# EAGLE design SDI-synchro-drive (EAGLE 7.1.0)
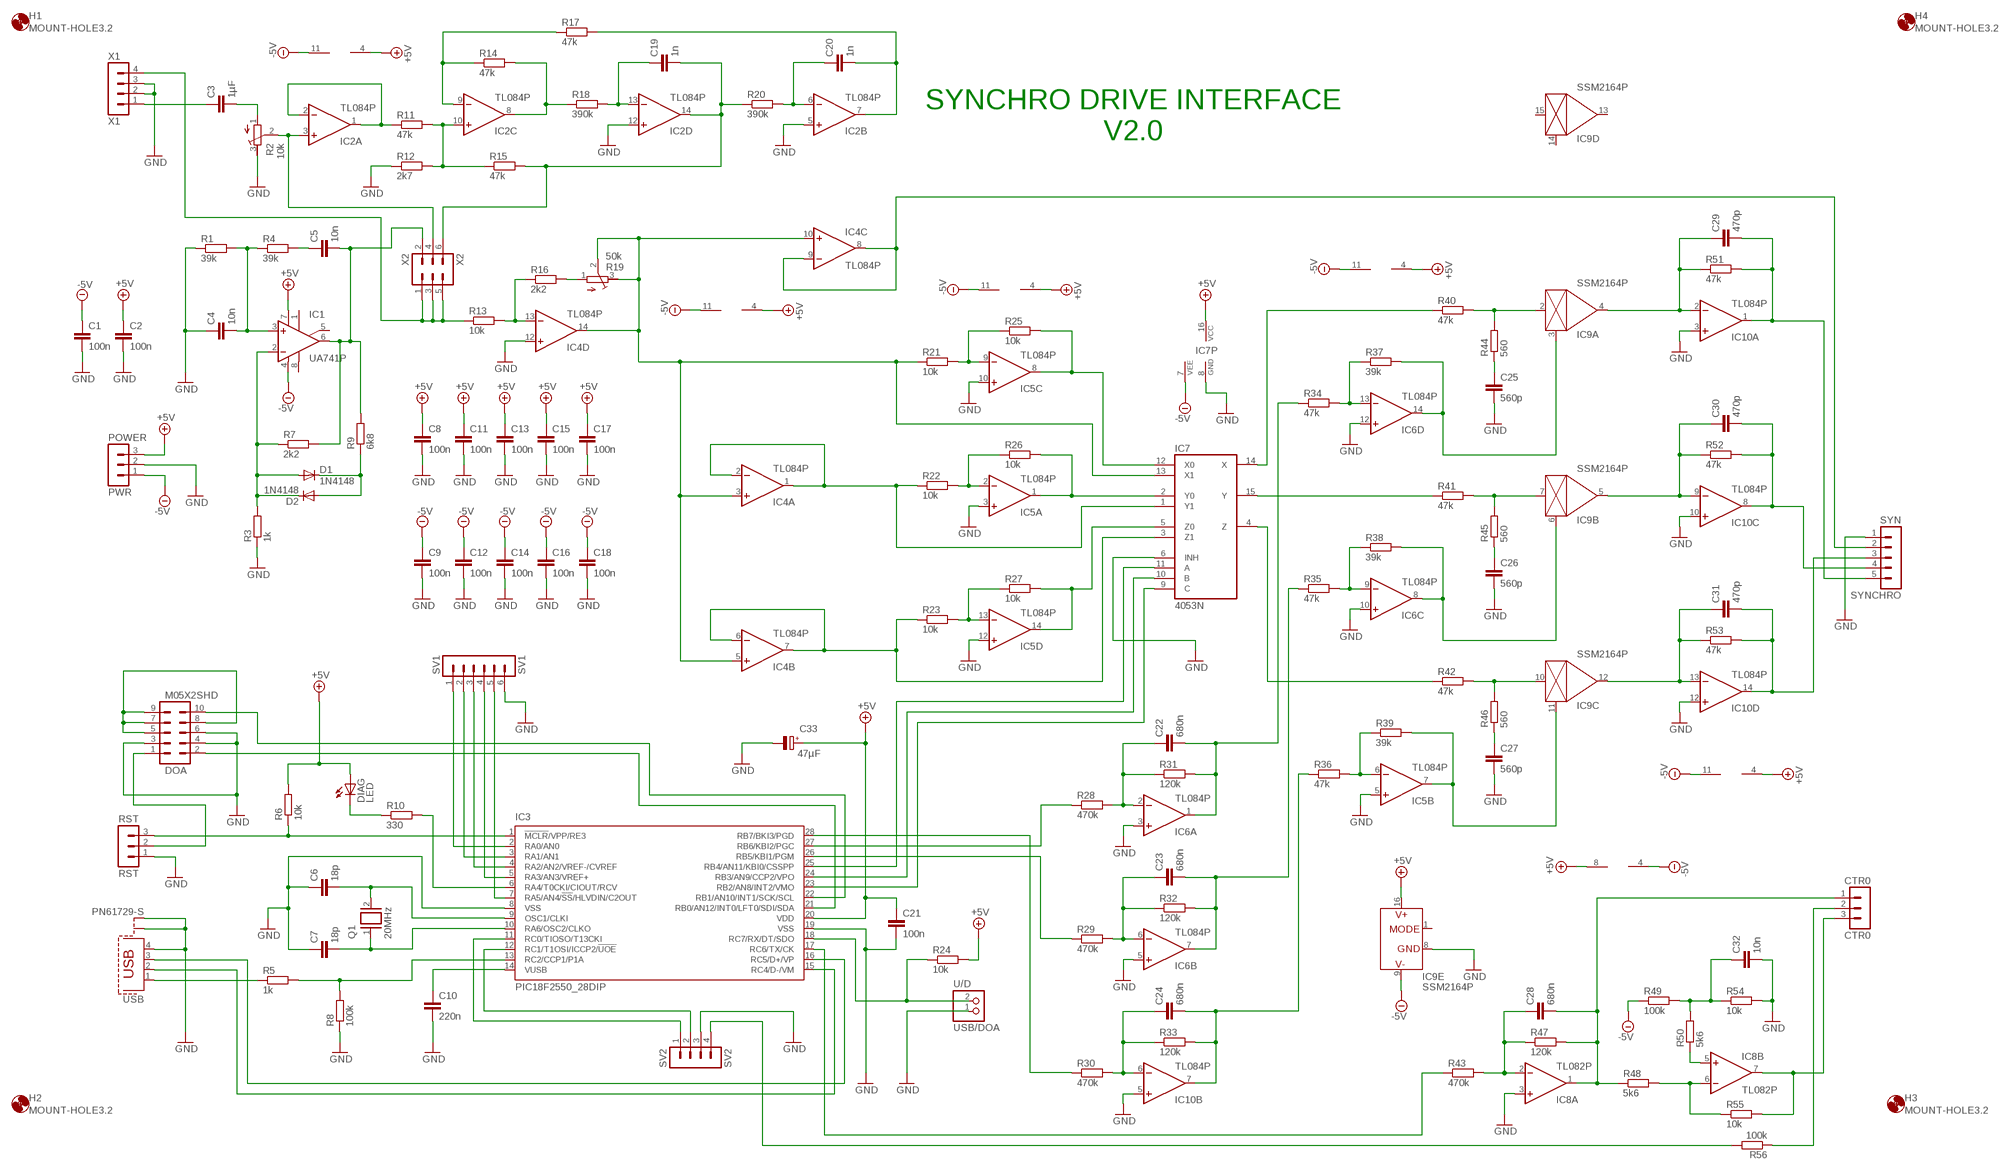
[diagram p0: schematic, sheet 1]

## Parts
C1  100n  C-EU025-025X050  [C025-025X050]
C2  100n  C-EU025-025X050  [C025-025X050]
C3  1µF  C5/3  [C5B3]
C4  10n  C-EU025-025X050  [C025-025X050]
C5  10n  C-EU025-025X050  [C025-025X050]
C6  18p  C-EU025-025X050  [C025-025X050]
C7  18p  C-EU025-025X050  [C025-025X050]
C8  100n  C-EU025-025X050  [C025-025X050]
C9  100n  C-EU025-025X050  [C025-025X050]
C10  220n  C5/3  [C5B3]
C11  100n  C-EU025-025X050  [C025-025X050]
C12  100n  C-EU025-025X050  [C025-025X050]
C13  100n  C-EU025-025X050  [C025-025X050]
C14  100n  C-EU025-025X050  [C025-025X050]
C15  100n  C-EU025-025X050  [C025-025X050]
C16  100n  C-EU025-025X050  [C025-025X050]
C17  100n  C-EU025-025X050  [C025-025X050]
C18  100n  C-EU025-025X050  [C025-025X050]
C19  1n  C-EU025-025X050  [C025-025X050]
C20  1n  C-EU025-025X050  [C025-025X050]
C21  100n  C-EU025-025X050  [C025-025X050]
C22  680n  C5/3  [C5B3]
C23  680n  C5/3  [C5B3]
C24  680n  C5/3  [C5B3]
C25  560p  C-EU025-025X050  [C025-025X050]
C26  560p  C-EU025-025X050  [C025-025X050]
C27  560p  C-EU025-025X050  [C025-025X050]
C28  680n  C5/3  [C5B3]
C29  470p  C-EU025-025X050  [C025-025X050]
C30  470p  C-EU025-025X050  [C025-025X050]
C31  470p  C-EU025-025X050  [C025-025X050]
C32  10n  C-EU025-025X050  [C025-025X050]
C33  47µF  CPOL-EUE2.5-6  [E2,5-6]
CTR0  CTR0  MA03-1  [MA03-1]
D1  1N4148  1N4148DO35-7  [DO35-7]
D2  1N4148  1N4148DO35-7  [DO35-7]
DIAG  LED  LED3MM  [LED3MM]
DOA  M05X2SHD  [2X5-SHROUDED]
H1  MOUNT-HOLE3.2  [3,2]
H2  MOUNT-HOLE3.2  [3,2]
H3  MOUNT-HOLE3.2  [3,2]
H4  MOUNT-HOLE3.2  [3,2]
IC1  UA741P  [DIL08]
IC2  TL084P  [DIL14]
IC3  PIC18F2550_28DIP  [DIL28-3]
IC4  TL084P  [DIL14]
IC5  TL084P  [DIL14]
IC6  TL084P  [DIL14]
IC7  4053N  [DIL16]
IC8  TL082P  [DIL08]
IC9  SSM2164P  [DIL16]
IC10  TL084P  [DIL14]
POWER  PWR  MA03-1  [MA03-1]
Q1  20MHz  XTAL/S  [QS]
R1  39k  R-EU_0204/7  [0204/7]
R2  10k  R-TRIMM3299W  [RTRIM3299W]
R3  1k  R-EU_0204/7  [0204/7]
R4  39k  R-EU_0204/7  [0204/7]
R5  1k  R-EU_0204/7  [0204/7]
R6  10k  R-EU_0204/7  [0204/7]
R7  2k2  R-EU_0204/7  [0204/7]
R8  100k  R-EU_0204/7  [0204/7]
R9  6k8  R-EU_0204/7  [0204/7]
R10  330  R-EU_0204/7  [0204/7]
R11  47k  R-EU_0204/7  [0204/7]
R12  2k7  R-EU_0204/7  [0204/7]
R13  10k  R-EU_0204/7  [0204/7]
R14  47k  R-EU_0204/7  [0204/7]
R15  47k  R-EU_0204/7  [0204/7]
R16  2k2  R-EU_0204/7  [0204/7]
R17  47k  R-EU_0204/7  [0204/7]
R18  390k  R-EU_0204/7  [0204/7]
R19  50k  R-TRIMM3299W  [RTRIM3299W]
R20  390k  R-EU_0204/7  [0204/7]
R21  10k  R-EU_0204/7  [0204/7]
R22  10k  R-EU_0204/7  [0204/7]
R23  10k  R-EU_0204/7  [0204/7]
R24  10k  R-EU_0204/7  [0204/7]
R25  10k  R-EU_0204/7  [0204/7]
R26  10k  R-EU_0204/7  [0204/7]
R27  10k  R-EU_0204/7  [0204/7]
R28  470k  R-EU_0204/7  [0204/7]
R29  470k  R-EU_0204/7  [0204/7]
R30  470k  R-EU_0204/7  [0204/7]
R31  120k  R-EU_0204/7  [0204/7]
R32  120k  R-EU_0204/7  [0204/7]
R33  120k  R-EU_0204/7  [0204/7]
R34  47k  R-EU_0204/7  [0204/7]
R35  47k  R-EU_0204/7  [0204/7]
R36  47k  R-EU_0204/7  [0204/7]
R37  39k  R-EU_0204/7  [0204/7]
R38  39k  R-EU_0204/7  [0204/7]
R39  39k  R-EU_0204/7  [0204/7]
R40  47k  R-EU_0204/7  [0204/7]
R41  47k  R-EU_0204/7  [0204/7]
R42  47k  R-EU_0204/7  [0204/7]
R43  470k  R-EU_0204/7  [0204/7]
R44  560  R-EU_0204/7  [0204/7]
R45  560  R-EU_0204/7  [0204/7]
R46  560  R-EU_0204/7  [0204/7]
R47  120k  R-EU_0204/7  [0204/7]
R48  5k6  R-EU_0204/7  [0204/7]
R49  100k  R-EU_0204/7  [0204/7]
R50  5k6  R-EU_0204/7  [0204/7]
R51  47k  R-EU_0204/7  [0204/7]
R52  47k  R-EU_0204/7  [0204/7]
R53  47k  R-EU_0204/7  [0204/7]
R54  10k  R-EU_0204/7  [0204/7]
R55  10k  R-EU_0204/7  [0204/7]
R56  100k  R-EU_0204/7  [0204/7]
RST  RST  MA03-1  [MA03-1]
SV1  SV1  MA06-1  [MA06-1]
SV2  SV2  MA04-1  [MA04-1]
SYNCHRO  SYN  MA05-1  [MA05-1]
USB  PN61729-S  [PN61729-S]
USB/DOA  U/D  PINHD-1X2  [1X02]
X1  X1  MA04-1  [MA04-1]
X2  X2  MA03-2  [MA03-2]

## Nets
+5V [+5V]: C2.1 C8.1 C11.1 C13.1 C15.1 C17.1 C21.1 C33.+ DIAG.A IC1.7(V+) IC2.4(P:V+) IC3.20(VDD) IC4.4(P:V+) IC5.4(P:V+) IC6.4(P:V+) IC7.16(VCC) IC8.8(P:V+) IC9.16(E:V+) IC10.4(P:V+) POWER.3 R6.2 R24.2
-5V [-5V]: C1.1 C9.1 C12.1 C14.1 C16.1 C18.1 IC1.4(V-) IC2.11(P:V-) IC4.11(P:V-) IC5.11(P:V-) IC6.11(P:V-) IC7.7(VEE) IC8.4(P:V-) IC9.9(E:V-) IC10.11(P:V-) POWER.1 R49.1
GND [ground]: C1.2 C2.2 C4.1 C6.1 C7.1 C8.2 C9.2 C10.2 C11.2 C12.2 C13.2 C14.2 C15.2 C16.2 C17.2 C18.2 C21.2 C25.2 C26.2 C27.2 C32.2 C33.- DOA.3 DOA.4 DOA.6 IC2.5(B:+IN) IC2.12(D:+IN) IC3.8(VSS) IC3.19(VSS) IC4.12(D:+IN) IC5.3(A:+IN) IC5.5(B:+IN) IC5.10(C:+IN) IC5.12(D:+IN) IC6.3(A:+IN) IC6.5(B:+IN) IC6.10(C:+IN) IC6.12(D:+IN) IC7.6(INH) IC7.8(GND) IC8.3(A:+IN) IC9.8(E:GND) IC10.3(A:+IN) IC10.5(B:+IN) IC10.10(C:+IN) IC10.12(D:+IN) POWER.2 R1.1 R2.3(A) R3.1 R8.1 R12.1 R54.2 RST.1 SV1.6 SV2.3 SYNCHRO.1 USB.4 USB.S1 USB.S2 USB/DOA.1 X1.2 X1.3
N$1: IC8.6(B:-IN) R48.2 R55.1
N$2: CTR0.3 IC8.7(B:OUT) R55.2
N$3: C3.2 R2.1(E)
N$4: IC2.3(A:+IN) R2.2(S) X2.4
N$5: IC2.1(A:OUT) IC2.2(A:-IN) R11.1
N$6: IC2.10(C:+IN) R11.2 R12.2 R15.1
N$7: C20.1 IC2.6(B:-IN) R20.2
N$8: IC2.9(C:-IN) R14.1 R17.1
N$9: IC2.8(C:OUT) R14.2 R18.1
N$10: C19.1 IC2.13(D:-IN) R18.2
N$11: C19.2 IC2.14(D:OUT) R15.2 R20.1 X2.6
N$12: C20.2 IC2.7(B:OUT) R17.2
N$13: R13.1 X1.4 X2.1 X2.3 X2.5
N$14: IC4.13(D:-IN) R13.2 R16.1
N$15: R16.2 R19.1(E)
N$16: IC5.13(D:-IN) R23.2 R27.1
N$17: IC4.8(C:OUT) IC4.9(C:-IN) SYNCHRO.2
N$18: CTR0.2 R56.1
N$19: IC5.2(A:-IN) R22.2 R26.1
N$21: C5.2 IC1.6(OUT) R7.2 R9.2 X2.2
N$23: IC5.9(C:-IN) R21.2 R25.1
N$25: C5.1 R4.2
N$26: IC5.8(C:OUT) IC7.12(X0) R25.2
N$27: IC5.1(A:OUT) IC7.2(Y0) R26.2
N$28: C4.2 IC1.3(+IN) R1.2 R4.1
N$29: IC5.14(D:OUT) IC7.5(Z0) R27.2
N$30: D1.A D2.C IC1.2(-IN) R3.2 R7.1
N$31: D1.C D2.A R9.1
N$32: IC7.14(X) R40.1
N$33: IC9.2(A:IN) R40.2 R44.2
N$34: IC7.15(Y) R41.1
N$35: IC9.7(B:IN) R41.2 R45.2
N$36: IC7.4(Z) R42.1
N$37: IC9.10(C:IN) R42.2 R46.2
N$38: C25.1 R44.1
N$39: C26.1 R45.1
N$40: C27.1 R46.1
N$41: IC5.6(B:-IN) R36.2 R39.1
N$42: IC5.7(B:OUT) IC9.11(C:CTRL) R39.2
N$43: IC6.14(D:OUT) IC9.3(A:CTRL) R37.2
N$44: IC6.8(C:OUT) IC9.6(B:CTRL) R38.2
N$45: IC6.9(C:-IN) R35.2 R38.1
N$46: IC6.13(D:-IN) R34.2 R37.1
N$47: C22.1 IC6.2(A:-IN) R28.2 R31.1
N$48: C22.2 IC6.1(A:OUT) R31.2 R34.1
N$49: C23.1 IC6.6(B:-IN) R29.2 R32.1
N$50: C23.2 IC6.7(B:OUT) R32.2 R35.1
N$51: C10.1 IC3.14(VUSB)
N$52: C24.1 IC10.6(B:-IN) R30.2 R33.1
N$53: C24.2 IC10.7(B:OUT) R33.2 R36.1
N$54: IC3.16(RC5/D+/VP) USB.3
N$55: C29.1 IC9.4(A:OUT) IC10.2(A:-IN) R51.1
N$56: C29.2 IC10.1(A:OUT) R51.2 SYNCHRO.5
N$57: C30.1 IC9.5(B:OUT) IC10.9(C:-IN) R52.1
N$58: C30.2 IC10.8(C:OUT) R52.2 SYNCHRO.4
N$59: C31.1 IC9.12(C:OUT) IC10.13(D:-IN) R53.1
N$60: C31.2 IC10.14(D:OUT) R53.2 SYNCHRO.3
N$61: IC3.15(RC4/D-/VM) USB.2
N$62: R5.1 USB.1
N$63: IC3.13(RC2/CCP1/P1A) R5.2 R8.2
N$64: DOA.1 RST.2
N$65: C7.2 IC3.10(RA6/OSC2/CLKO) Q1.1
N$66: C6.2 IC3.9(OSC1/CLKI) Q1.2
N$67: IC3.1(!MCLR!/VPP/RE3) R6.1 RST.3
N$68: IC3.28(RB7/BKI3/PGD) R30.1
N$69: IC3.26(RB5/KBI1/PGM) R29.1
N$70: IC3.27(RB6/KBI2/PGC) R28.1
N$71 [+5V]: DOA.5 DOA.7 DOA.8 DOA.9
N$72: DOA.2 IC3.21(RB0/AN12/INT0/LFT0/SDI/SDA)
N$73: DIAG.K(C) R10.1
N$74: IC3.6(RA4/T0CKI/CIOUT/RCV) R10.2
N$75: DOA.10 IC3.22(RB1/AN10/INT1/SCK/SCL)
N$76: IC3.18(RC7/RX/DT/SDO) R24.1 USB/DOA.2
N$77: IC3.12(RC1/T1OSI/ICCP2/!UOE) SV2.2
N$78: IC3.25(RB4/AN11/KBI0/CSSPP) IC7.11(A)
N$79: IC3.24(RB3/AN9/CCP2/VPO) IC7.10(B)
N$80: IC3.23(RB2/AN8/INT2/VMO) IC7.9(C)
N$81: IC3.2(RA0/AN0) SV1.1
N$82: IC3.3(RA1/AN1) SV1.2
N$83: IC3.4(RA2/AN2/VREF-/CVREF) SV1.3
N$84: IC3.5(RA3/AN3/VREF+) SV1.4
N$85: IC3.7(RA5/AN4/!SS!/HLVDIN/C2OUT) SV1.5
N$86: IC3.11(RC0/TIOSO/T13CKI) SV2.1
N$87: IC3.17(RC6/TX/CK) R43.1
N$88: C28.1 IC8.2(A:-IN) R43.2 R47.1
N$89: C28.2 CTR0.1 IC8.1(A:OUT) R47.2 R48.1
N$91: C32.1 R49.2 R50.2 R54.1
N$92: IC8.5(B:+IN) R50.1
N$93: C3.1 X1.1
N$94: R56.2 SV2.4
SIN000: IC4.3(A:+IN) IC4.5(B:+IN) IC4.10(C:+IN) IC4.14(D:OUT) IC7.13(X1) R19.2(S) R19.3(A) R21.1
SIN120: IC4.1(A:OUT) IC4.2(A:-IN) IC7.1(Y1) R22.1
SIN240: IC4.6(B:-IN) IC4.7(B:OUT) IC7.3(Z1) R23.1
Unconnected: IC1.1(ON1) IC1.5(ON2) IC1.8(OPT) IC9.1(E:MODE) IC9.13(D:OUT) IC9.14(D:CTRL) IC9.15(D:IN)

## Notes on the sheet
- SYNCHRO DRIVE INTERFACE
  V2.0

## Library data of the parts
C1 C2 C4-C9 C11-C21 C25-C27 C29-C32 = rcl:C-EU: CAPACITOR, European symbol
C3 C10 C22-C24 C28 = capacitor-wima:C: CAPACITOR naming: grid - package width
C33 = resistor:CPOL-EU: POLARIZED CAPACITOR, European symbol
CTR0 POWER RST = con-lstb:MA03-1: PIN HEADER; OC_FARNELL: unknown; OC_NEWARK: unknown
D1 D2 = diode:1N4148: DIODE high speed (Philips)
DIAG = henk:LED: LEDs Standard schematic elements and footprints for 5mm, 3mm, 1206, and 0603 sized LEDs. 5mm - Spark Fun Electronics SKU : COM-00529 (and others)
DOA = henk:M05X2: Header 5x2 Standard 10-pin dual row 0.1" header. Commonly used with AVR-ISP. Use with Spark Fun Electronics SKU: PRT-00778
H1-H4 = holes:MOUNT-HOLE: MOUNTING HOLE with drill center marker
IC1 = linear:*741: OP AMP
IC2 IC4-IC6 IC10 = linear:TL084: OP AMP
IC3 = microchip:PIC18F2*_28: USB Microcontrollers with nanoWatt Technology High-Performance, Enhanced Flash, 28/40/44-Pin, Source: http://ww1.microchip.com/downloads/en/devicedoc/39632c.pdf; MF: MICROCHIP; MPN: PIC18F2550-I/SP; OC_FARNELL: 1523822; OC_NEWARK: 80K6054
IC7 = 40xx:4053: Triple 2-channel ANALOG MULTIPLEXER
IC8 = linear:TL082: OP AMP Data sheet <http://www.ti.com/lit/ds/symlink/tl084a . pdf>; DATA_SHEET: <a href="http://www.ti.com/lit/ds/symlink/tl084a.pdf"> Data sheet </a>
IC9 = ssm2164:SSM2164
Q1 = special:XTAL/S: CRYSTAL
R1 R3-R18 R20-R56 = rcl:R-EU_: RESISTOR, European symbol
R2 R19 = rcl:R-TRIMM: Trimm resistor
SV1 = con-lstb:MA06-1: PIN HEADER; OC_FARNELL: unknown; OC_NEWARK: unknown
SV2 X1 = con-lstb:MA04-1: PIN HEADER; OC_FARNELL: unknown; OC_NEWARK: unknown
SYNCHRO = con-lstb:MA05-1: PIN HEADER; OC_FARNELL: unknown; OC_NEWARK: unknown
USB = con-berg:PN61729-S: BERG USB connector; OC_FARNELL: unknown; OC_NEWARK: unknown
USB/DOA = pinhead:PINHD-1X2: PIN HEADER
X2 = con-lstb:MA03-2: PIN HEADER; OC_FARNELL: unknown; OC_NEWARK: unknown

## Net classes
1 ground: width 0.508 mm
2 +5V: width 0.508 mm
3 -5V: width 0.508 mm

## Board
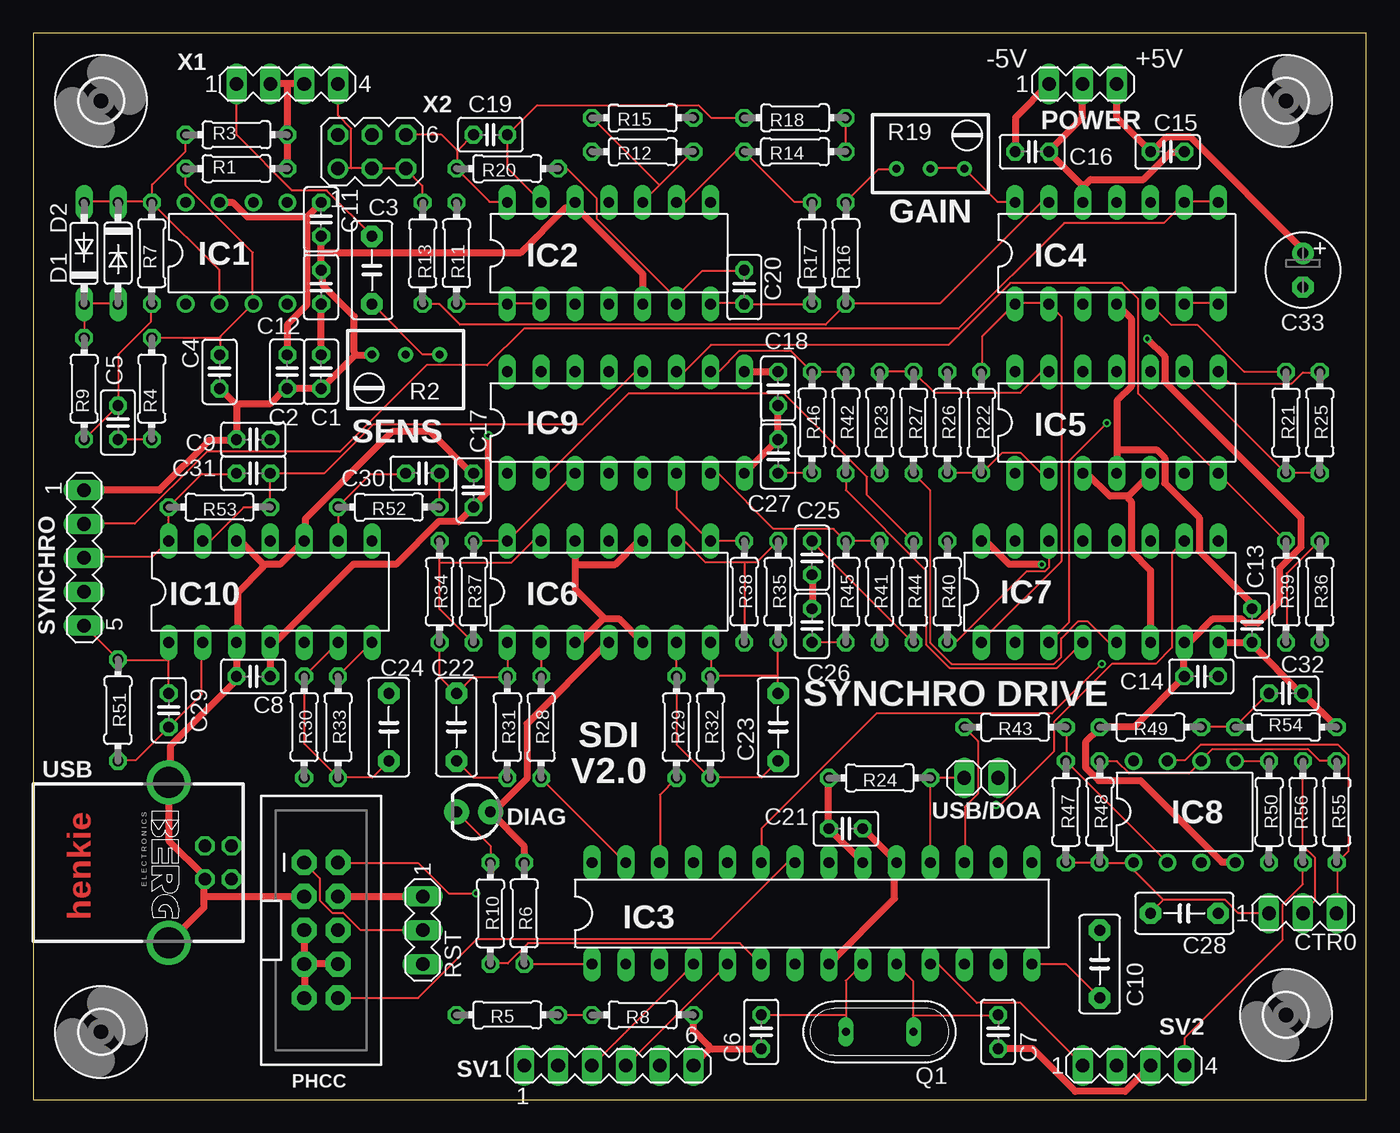
[diagram p1: board, top side]
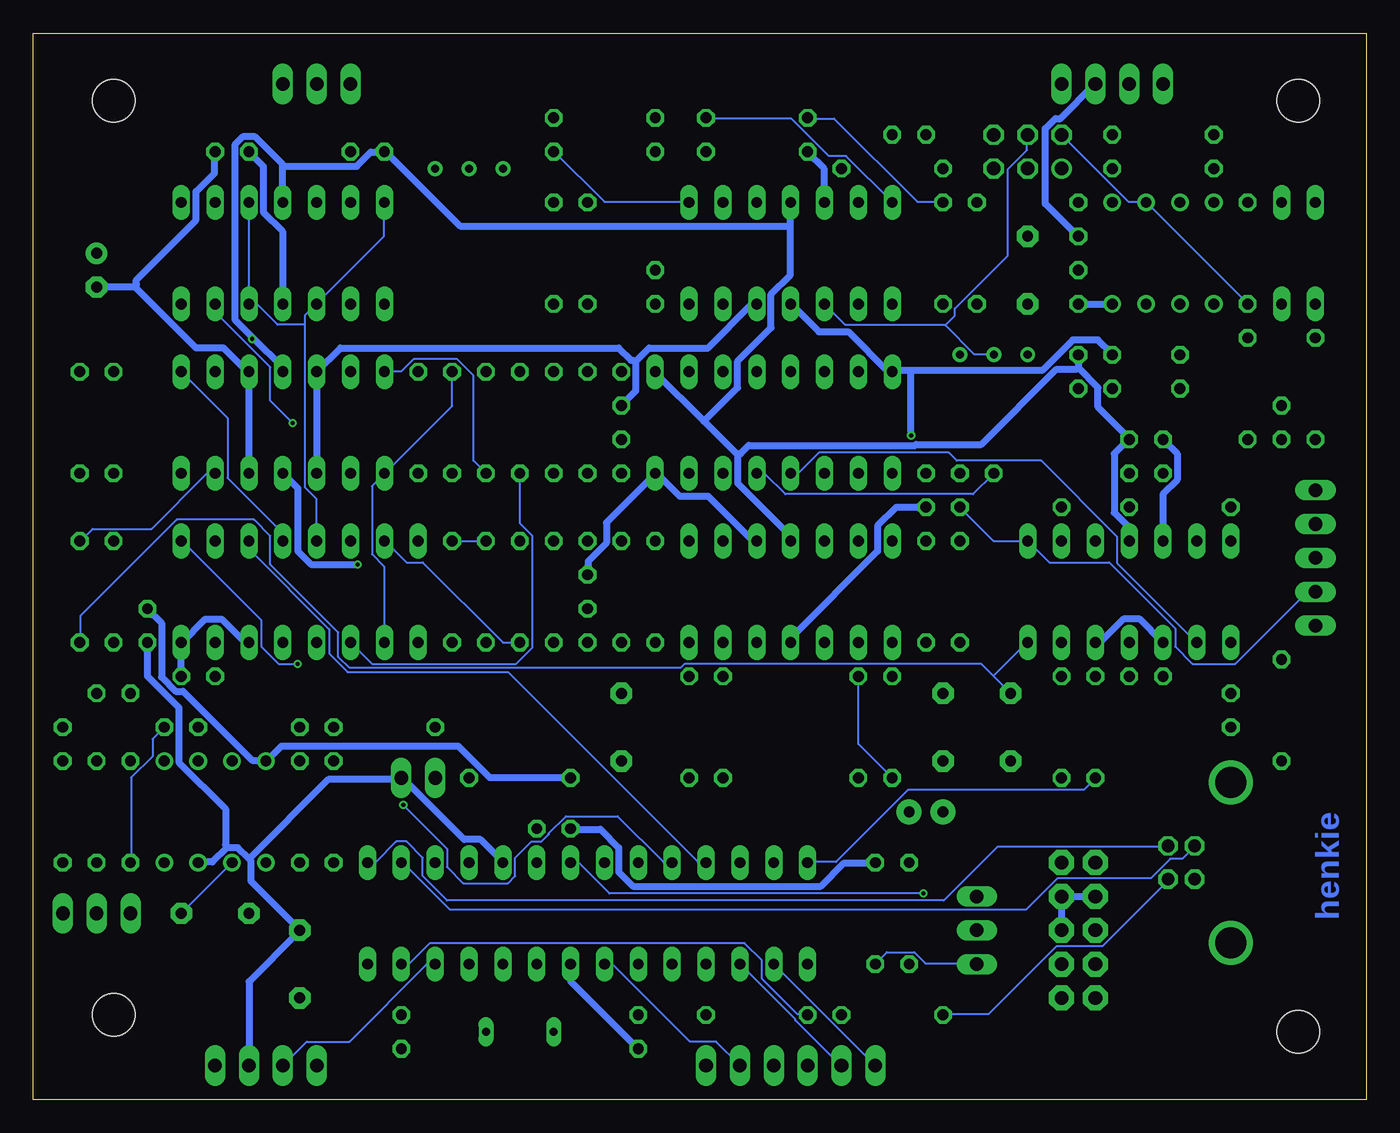
[diagram p2: board, bottom side, seen from below]

Size 100 x 80 mm. Coordinates in mm from the lower left corner, seen from the top.
Outline: 0,0 100,0 100,80 0,80 0,0
Copper layers (1*16): Top 0.035mm / dielectric 1.5mm / Bottom 0.035mm
Design rules "ITEADstudio_DRC": minimum track width 6mil, minimum drill 12mil, track to track 6mil, track to pad 6mil, pad to pad 6mil, via to via 6mil, smd to smd 0mil, copper to edge 10mil, drill to drill 10mil, minimum pad ring 10mil, minimum via ring 6mil, stop-mask expansion 2mil, vias tented up to drill 100mil, thermal gap 10mil

### Footprints (pad centres in the part's own frame; a part is rotated, then mirrored left to right if it is on the bottom)
C025-025X050 = drill 0.813 octagon: 1 -1.27,0; 2 1.27,0
C5B3 = drill 0.813 pad 1.6 octagon: 1 -2.54,0; 2 2.54,0
E2,5-6 = drill 0.813 pad 1.6: + -1.27,0 | drill 0.813 pad 1.6 octagon: - 1.27,0
MA03-1 = drill 1.016 long: 1 -2.54,0; 2 0,0; 3 2.54,0
DO35-7 = drill 0.813 long: A 3.81,0; C -3.81,0
LED3MM = drill 0.813 pad 1.88: A -1.27,0; K 1.27,0
2X5-SHROUDED = drill 1.016 pad 1.88 octagon: 1 -1.27,5.08; 2 1.27,5.08; 3 -1.27,2.54; 4 1.27,2.54; 5 -1.27,0; 6 1.27,0; 7 -1.27,-2.54; 8 1.27,-2.54; 9 -1.27,-5.08; 10 1.27,-5.08
3,2 = hole 3.2: 0,0
DIL08 = drill 0.813 pad 1.27: 1 -3.81,-3.81; 2 -1.27,-3.81; 3 1.27,-3.81; 4 3.81,-3.81; 5 3.81,3.81; 6 1.27,3.81; 7 -1.27,3.81; 8 -3.81,3.81
DIL14 = drill 0.813 long: 1 -7.62,-3.81; 2 -5.08,-3.81; 3 -2.54,-3.81; 4 0,-3.81; 5 2.54,-3.81; 6 5.08,-3.81; 7 7.62,-3.81; 8 7.62,3.81; 9 5.08,3.81; 10 2.54,3.81; 11 0,3.81; 12 -2.54,3.81; 13 -5.08,3.81; 14 -7.62,3.81
DIL28-3 = drill 0.813 long: 1 -16.51,-3.81; 2 -13.97,-3.81; 3 -11.43,-3.81; 4 -8.89,-3.81; 5 -6.35,-3.81; 6 -3.81,-3.81; 7 -1.27,-3.81; 8 1.27,-3.81; 9 3.81,-3.81; 10 6.35,-3.81; 11 8.89,-3.81; 12 11.43,-3.81; 13 13.97,-3.81; 14 16.51,-3.81; 15 16.51,3.81; 16 13.97,3.81; 17 11.43,3.81; 18 8.89,3.81; 19 6.35,3.81; 20 3.81,3.81; 21 1.27,3.81; 22 -1.27,3.81; 23 -3.81,3.81; 24 -6.35,3.81; 25 -8.89,3.81; 26 -11.43,3.81; 27 -13.97,3.81; 28 -16.51,3.81
DIL16 = drill 0.813 long: 1 -8.89,-3.81; 2 -6.35,-3.81; 3 -3.81,-3.81; 4 -1.27,-3.81; 5 1.27,-3.81; 6 3.81,-3.81; 7 6.35,-3.81; 8 8.89,-3.81; 9 8.89,3.81; 10 6.35,3.81; 11 3.81,3.81; 12 1.27,3.81; 13 -1.27,3.81; 14 -3.81,3.81; 15 -6.35,3.81; 16 -8.89,3.81
QS = drill 0.61 long: 1 -2.54,0; 2 2.54,0
0204/7 = drill 0.813 octagon: 1 -3.81,0; 2 3.81,0
RTRIM3299W = drill 0.61: 1 1.27,-2.54; 2 1.27,0; 3 1.27,2.54
MA06-1 = drill 1.016 long: 1 -6.35,0; 2 -3.81,0; 3 -1.27,0; 4 1.27,0; 5 3.81,0; 6 6.35,0
MA04-1 = drill 1.016 long: 1 -3.81,0; 2 -1.27,0; 3 1.27,0; 4 3.81,0
MA05-1 = drill 1.016 long: 1 -5.08,0; 2 -2.54,0; 3 0,0; 4 2.54,0; 5 5.08,0
PN61729-S = drill 0.95 octagon: 1 1.25,4.71; 2 -1.25,4.71; 3 -1.25,2.71; 4 1.25,2.71 | drill 2.3 pad 2.9: S1 -6.02,0; S2 6.02,0
1X02 = drill 1.016 long: 1 -1.27,0; 2 1.27,0
MA03-2 = drill 1.016: 1 -2.54,-1.27 | drill 1.016 octagon: 2 -2.54,1.27; 3 0,-1.27; 4 0,1.27; 5 2.54,-1.27; 6 2.54,1.27

### Placement (x,y rotation side)
C1  21.59,54.61 270 top
C2  19.05,54.61 270 top
C3  25.4,62.23 270 top
C4  13.97,54.61 90 top
C5  6.35,50.8 90 top
C6  54.61,5.08 90 top
C7  72.39,5.08 90 top
C8  16.51,31.75 180 top
C9  16.51,49.53 180 top
C10  80.01,10.16 90 top
C11  21.59,66.04 270 top
C12  21.59,60.96 90 top
C13  91.44,35.56 270 top
C14  87.63,31.75 0 top
C15  85.09,71.12 0 top
C16  74.93,71.12 0 top
C17  33.02,45.72 90 top
C18  55.88,53.34 270 top
C19  34.29,72.39 180 top
C20  53.34,60.96 270 top
C21  60.96,20.32 0 top
C22  31.75,27.94 90 top
C23  55.88,27.94 90 top
C24  26.67,27.94 90 top
C25  58.42,40.64 270 top
C26  58.42,35.56 90 top
C27  55.88,48.26 90 top
C28  86.36,13.97 180 top
C29  10.16,29.21 90 top
C30  29.21,46.99 0 top
C31  16.51,46.99 180 top
C32  93.98,30.48 0 top
C33  95.25,62.23 270 top
CTR0  95.25,13.97 0 top
D1  3.81,63.5 90 top
D2  6.35,63.5 270 top
DIAG  33.02,21.59 180 top
DOA  21.59,12.7 0 top
H1  5.08,74.93 0 top
H2  93.98,6.35 0 top
H3  5.08,5.08 0 top
H4  93.98,74.93 0 top
IC1  15.24,63.5 0 top
IC2  43.18,63.5 0 top
IC3  58.42,13.97 0 top
IC4  81.28,63.5 0 top
IC5  81.28,50.8 0 top
IC6  43.18,38.1 0 top
IC7  80.01,38.1 0 top
IC8  86.36,21.59 0 top
IC9  44.45,50.8 0 top
IC10  17.78,38.1 0 top
POWER  78.74,76.2 0 top
Q1  63.5,5.08 180 top
R1  15.24,69.85 180 top
R2  27.94,54.61 90 top
R3  15.24,72.39 180 top
R4  8.89,53.34 270 top
R5  35.56,6.35 0 top
R6  36.83,13.97 90 top
R7  8.89,63.5 270 top
R8  45.72,6.35 180 top
R9  3.81,53.34 270 top
R10  34.29,13.97 270 top
R11  31.75,63.5 90 top
R12  45.72,71.12 0 top
R13  29.21,63.5 270 top
R14  57.15,71.12 0 top
R15  45.72,73.66 0 top
R16  60.96,63.5 90 top
R17  58.42,63.5 270 top
R18  57.15,73.66 180 top
R19  67.31,71.12 270 top
R20  35.56,69.85 0 top
R21  93.98,50.8 270 top
R22  71.12,50.8 270 top
R23  63.5,50.8 90 top
R24  63.5,24.13 180 top
R25  96.52,50.8 90 top
R26  68.58,50.8 90 top
R27  66.04,50.8 270 top
R28  38.1,27.94 90 top
R29  48.26,27.94 90 top
R30  20.32,27.94 90 top
R31  35.56,27.94 90 top
R32  50.8,27.94 90 top
R33  22.86,27.94 90 top
R34  30.48,38.1 90 top
R35  55.88,38.1 90 top
R36  96.52,38.1 90 top
R37  33.02,38.1 90 top
R38  53.34,38.1 90 top
R39  93.98,38.1 90 top
R40  68.58,38.1 90 top
R41  63.5,38.1 90 top
R42  60.96,50.8 90 top
R43  73.66,27.94 0 top
R44  66.04,38.1 90 top
R45  60.96,38.1 90 top
R46  58.42,50.8 90 top
R47  77.47,21.59 270 top
R48  80.01,21.59 90 top
R49  83.82,27.94 0 top
R50  92.71,21.59 270 top
R51  6.35,29.21 90 top
R52  26.67,44.45 0 top
R53  13.97,44.45 180 top
R54  93.98,27.94 0 top
R55  97.79,21.59 270 top
R56  95.25,21.59 270 top
RST  29.21,12.7 270 top
SV1  43.18,2.54 0 top
SV2  82.55,2.54 0 top
SYNCHRO  3.81,40.64 270 top
USB  10.16,17.78 270 top
USB/DOA  71.12,24.13 180 top
X1  19.05,76.2 0 top
X2  25.4,71.12 0 top

### Tracks (layer width: path | path; a pad name or v marks a point on that pad's centre or on a via)
+5V  (via drill 0.3)
  Top 0.508: C2.1 19.05,58.14 20.5,59.59 20.5,66.22 | C11.1 20.5,66.22 | 20.5,66.22 16.08,66.22 15.01,67.28 14.02,67.28 IC1.7 | R6.2 36.8,17.83 36.8,19.05 34.29,21.57 DIAG.A 34.52,21.72 34.67,21.72 37.03,24.08 37.03,28.19 43.13,34.29 IC6.4 | C8.1 17.75,31.77 17.75,34.29 IC10.4 17.98,34.44 18.29,34.44 24,40.16 27.2,40.16 30.4,43.36 31.93,43.36 C17.1 33.15,44.65 34.14,45.64 v34.14,49.84 | IC3.20 C21.1 59.66,20.5 59.66,24.08 R24.2 | IC7.16 71.48,41.91 73.23,40.16 v75.67,40.16 | POWER.3 81.31,76.2 81.31,73.69 83.82,71.17 C15.1 84.05,71.25 85.04,72.24 86.79,72.24 95.25,63.78 C33.+ | 81.31,48.77 81.31,52.43 82.37,53.49 82.37,58.6 IC4.4 | 81.31,48.77 81.31,47.02 IC5.4 | C13.1 91.44,37.19 87.48,41.15 87.48,43.66 84.89,46.25 84.89,48.16 84.28,48.77 81.31,48.77
  Bottom 0.508: IC2.4 43.13,59.66 41.07,57.61 38.86,57.61 35.89,54.63 35.59,54.63 IC9.16 35.36,54.71 34.14,54.71 | 34.14,54.71 24.31,54.71 22.02,57 20.12,57 19.05,55.93 C2.1 | IC6.4 43.13,34.29 43.13,34.67 36.65,41.15 36.65,43.05 35.28,44.42 33.07,44.42 C17.1 | v34.14,49.84 34.14,54.71 | C13.1 91.44,36.8 90.37,35.74 90.37,31.7 89.31,30.63 88.77,30.63 83.59,25.45 82.6,25.45 IC8.8 82.37,25.53 81.38,26.52 68.12,26.52 65.76,24.16 59.74,24.16 R24.2 | v75.67,40.16 79.17,40.16 80.16,41.15 80.16,45.87 IC5.4 | IC4.4 81.31,59.74 81.31,65.15 82.75,66.6 82.75,70.03 83.82,71.09 C15.1 | R6.2 36.88,17.75 39.17,17.75 40.92,16 55.02,16 56.08,17.07 56.08,18.9 57.45,20.27 59.66,20.27 C21.1
-5V  (via drill 0.3)
  Top 0.508: C1.1 21.57,55.93 21.57,59.66 C12.1 | C18.1 55.85,54.63 53.34,54.63 IC9.9 | IC8.4 90.14,17.83 89.15,17.83 83.06,23.93 79.93,23.93 78.94,24.92 78.94,26.82 79.86,27.74 R49.1 80.01,27.96 82.6,27.96 86.33,31.7 C14.1 86.33,32 86.33,34.29 IC7.7 86.56,34.44 86.87,34.44 88.47,36.04 90.68,36.04 90.98,35.74 91.9,35.74 93.5,37.34 93.5,39.85 95.1,41.45 95.1,43.66 84.89,53.87 84.89,55.78 v83.59,57.07 | POWER.1 73.69,73.69 73.69,71.17 C16.1
  Bottom 0.508: IC1.4 19.05,59.66 21.57,59.66 C12.1 | IC10.11 17.83,41.91 17.83,42.98 18.9,44.04 18.9,48.46 17.83,49.53 C9.1 17.91,49.76 20.12,51.97 20.12,53.42 21.57,54.86 | 21.57,54.86 21.57,55.85 C1.1 | 47.17,48.39 47.17,46.25 43.2,42.29 43.2,41.91 IC6.11 | 49.68,50.9 53.34,54.56 IC9.9 | 49.68,50.9 47.17,48.39 | 43.2,65.53 43.2,61.87 44.65,60.43 44.65,57.91 47.17,55.4 47.17,53.42 49.68,50.9 | 43.2,65.53 43.2,67.28 IC2.11 | 21.57,54.86 21.79,54.79 23.24,54.79 28.88,49.15 33.76,49.15 33.83,49.07 46.33,49.07 46.94,48.46 47.17,48.39 | 83.52,57.15 84.89,58.52 84.89,71.63 84.28,72.24 83.36,72.24 81.31,70.18 81.31,70.03 | 83.52,57.15 81.31,54.94 81.31,54.63 IC5.11 | 81.31,70.03 81.31,67.36 IC4.11 | 81.31,70.03 75.74,70.03 74.68,71.09 73.69,71.09 C16.1 73.46,71.02 67.97,65.53 43.2,65.53 | v83.59,57.07 83.52,57.15
GND
  Top 0.508: IC2.5 45.72,61.95 40.69,66.98 40.69,67.28 IC2.12 40.46,66.9 39.93,66.9 36.58,63.55 21.57,63.55 | IC6.3 41,34.29 42.75,36.04 | 42.75,36.04 43.97,36.04 IC6.5 | 40.69,40.16 40.69,38.25 42.67,36.27 42.75,36.04 | 40.69,40.16 40.69,41.91 IC6.12 | IC6.10 45.41,41.91 43.66,40.16 40.69,40.16 | C26.2 58.45,36.88 58.45,39.32 C25.2 | IC9.8 53.34,47.02 55.85,49.53 C27.2 55.85,49.76 55.85,52.05 C18.2 | DOA.4 RST.1 | 12.8,15.24 12.8,14.4 10.21,11.81 USB.S2 | 12.8,15.24 12.8,16.46 USB.4 12.8,16.76 10.21,19.36 10.21,23.77 USB.S1 10.29,24 10.29,26.52 15.09,31.32 15.09,31.55 C8.2 IC10.3 15.32,34.52 15.32,38.02 17.22,39.93 17.3,40.16 | 12.8,15.24 DOA.3 | IC10.12 15.54,41.91 17.3,40.16 | 17.3,40.16 18.52,40.16 20.27,41.91 IC10.10 20.42,42.14 20.42,43.59 26.98,50.14 29.72,50.14 32.84,47.02 32.99,47.02 C17.2 | 15.24,52.12 C9.2 15.01,49.45 13.18,49.45 9.45,45.72 SYNCHRO.1 | 15.24,52.12 14.02,53.34 C4.1 | R1.1 R3.1 19.05,76.2 | X1.3 19.05,76.2 | 19.05,76.2 X1.2 | 21.57,63.55 21.57,64.77 C11.2 | 21.57,63.55 21.57,62.26 C12.2 21.72,62.03 21.72,61.11 24.08,58.75 24.08,56.08 24.16,55.85 | 24.16,55.85 25.38,55.85 R2.3 | 24.16,55.85 21.64,53.34 C1.2 C2.2 18.82,53.26 17.75,52.2 15.47,52.2 15.24,52.12 | C7.1 74.98,3.81 78.18,0.61 81.92,0.61 83.82,2.52 SV2.3 | C21.2 62.26,20.34 64.77,17.83 IC3.19 64.62,17.6 64.62,15.09 IC3.8 | 50.75,3.81 C6.1 | 50.75,3.81 49.53,2.59 SV1.6 | R8.1 49.53,5.18 50.67,4.04 50.75,3.81 | R54.2 C32.2 95.02,30.56 91.52,34.06 C13.2 IC7.8 | 78.72,68.58 78.72,67.36 IC4.12 | 78.72,68.58 76.2,71.09 C16.2 76.35,71.32 78.72,73.69 78.72,76.2 POWER.2 | C15.2 86.33,71.09 85.34,71.09 83.29,69.04 79.32,69.04 78.94,68.66 78.72,68.58
  Top 0.508: 82.14,45.26 80.77,45.26 79.1,46.94 78.79,46.94 IC5.3 | 82.14,45.26 83.82,46.94 IC5.5 | IC7.6 83.82,39.7 82.37,41.15 82.37,44.88 82.22,45.03 82.14,45.26
  Bottom 0.508: IC2.12 40.69,67.36 40.69,69.88 41.91,71.09 R12.1 | C25.2 58.37,39.4 58.37,40.39 57,41.76 57,43.28 53.34,46.94 IC9.8 53.11,46.86 51.51,45.26 49.38,45.26 46.02,41.91 IC6.10 | 54.79,55.4 53.8,56.39 49.38,56.39 46.1,59.66 45.72,59.66 IC2.5 | 54.79,55.4 54.79,53.19 55.85,52.12 C18.2 | DOA.6 DOA.4 DOA.3 | IC10.5 19.96,34.29 18.21,36.04 16.99,36.04 IC10.3 | X1.3 20.34,76.2 22.94,73.61 23.32,73.61 24.08,72.85 24.08,67.21 21.64,64.77 C11.2 | IC10.12 15.24,45.41 14.17,46.48 14.17,48.46 C9.2 | 85.5,18.9 86.56,17.83 87.63,17.83 IC8.3 | 85.5,18.9 84.66,18.9 83.82,18.06 | 83.82,18.06 83.67,17.91 83.67,16.38 80.01,12.72 C10.2 80.16,12.5 83.82,8.84 SV2.3 | IC3.19 64.77,17.83 66.45,19.51 67.67,19.51 72.24,24.08 72.39,24.08 USB/DOA.1 72.62,24 77.88,24 83.82,18.06 | IC3.8 59.66,10.13 59.66,8.84 54.63,3.81 C6.1 | IC7.6 84.12,34.29 85.88,36.04 87.1,36.04 88.85,34.29 IC7.8 88.92,34.06 88.92,31.77 C14.2 | IC5.3 78.72,47.02 78.72,54.56 IC5.12 76.96,56.39 56.08,56.39 55.17,55.47 55.02,55.47 54.79,55.4 | IC5.5 IC5.10 84.05,54.71 85.72,56.39 87.78,56.39 92.35,60.96 | 92.35,60.96 C33.- | C15.2 86.41,71.09 86.41,69.49 87.78,68.12 87.78,65.99 92.28,61.49 92.28,61.19 92.35,60.96 | C13.2 91.44,31.77 89.08,29.41 89.08,25.3 85.57,21.79 85.57,19.13 85.5,18.9
N$1
  Top 0.152: R48.2 80.01,25.38 81.31,25.38 82.22,24.46 86.72,24.46 87.63,25.38 IC8.6 87.63,25.45 88.47,26.29 95.63,26.29 96.47,25.45 97.77,25.45 R55.1
N$2
  Top 0.152: IC8.7 85.11,25.45 86.41,25.45 87.55,26.59 97.92,26.59 98.68,25.83 98.68,18.67 R55.2 97.84,17.75 97.84,14.02 CTR0.3
N$3
  Top 0.152: R2.1 30.48,55.93 29.18,55.93 25.45,59.66 C3.2
N$4
  Bottom 0.152: 31.59,58.1 31.62,58.14 39.09,58.14 IC2.3 | 31.59,58.1 29.41,55.93 27.96,55.93 R2.2 | 31.59,58.1 30.86,58.83 30.86,59.36 26.9,63.32 26.9,69.8 25.45,71.25 25.45,72.39 X2.4
N$5
  Top 0.152: R11.1 31.77,59.66 35.51,59.66 IC2.1 35.59,59.74 38.1,59.74 IC2.2
N$6
  Top 0.152: 46.98,68.62 49.53,71.17 R12.2 | 46.98,68.62 45.72,67.36 IC2.10 | 46.98,68.62 41.91,73.69 R15.1
  Bottom 0.152: R11.2 31.77,67.36 33.68,67.36 39.93,73.61 41.91,73.61 R15.1
N$7
  Top 0.152: R20.2 39.4,69.8 40.08,69.8 42.29,67.59 42.29,66.06 48.23,60.12 48.23,59.74 IC2.6 48.23,60.2 50.22,62.18 53.34,62.18 C20.1
N$8
  Top 0.152: 53.34,71.09 52.65,71.09 48.92,67.36 48.31,67.36 IC2.9 | 53.34,71.09 57.07,67.36 58.37,67.36 R17.1 | 53.34,71.09 R14.1
N$9
  Top 0.152: R14.2 R18.1
  Bottom 0.152: IC2.8 50.83,67.36 57.15,67.36 60.96,71.17 R14.2
N$10
  Top 0.152: 35.59,72.39 35.59,69.88 38.1,67.36 IC2.13 | 35.59,72.39 37.8,74.6 49.91,74.6 50.83,73.69 53.34,73.69 R18.2 | 35.59,72.39 C19.1
N$11
  Top 0.152: 31.81,71.21 32.99,72.39 C19.2 | 31.81,71.21 31.77,71.17 31.77,69.88 R20.1 31.77,69.8 34.21,67.36 35.51,67.36 IC2.14 | X2.6 30.63,72.39 31.81,71.21
  Bottom 0.152: R15.2 49.53,73.61 43.13,73.61 40.31,70.79 39.01,70.79 35.59,67.36 IC2.14
N$12
  Top 0.152: IC2.7 50.83,59.74 53.34,59.74 C20.2 53.34,59.66 58.37,59.66 R17.2
N$13
  Top 0.152: R13.1 29.18,67.36 29.18,68.58 27.96,69.8 X2.5 27.89,69.88 25.45,69.88 X2.3 25.38,69.88 23.85,69.88 | 23.85,69.88 22.86,69.88 X2.1 | X1.4 22.86,73.84 23.85,72.85 23.85,69.88
N$14
  Top 0.152: R13.2 29.26,59.66 30.48,59.66 32,58.14 59.44,58.14 60.96,59.66 R16.1 60.96,59.74 68.05,59.74 75.59,67.28 76.2,67.28 IC4.13
N$15
  Top 0.152: R19.1 64.77,69.8 63.4,69.8 60.96,67.36 R16.2
N$16
  Top 0.152: R23.2 63.55,54.63 65.99,54.63 R27.1 66.06,54.56 67.59,53.03 74.07,53.03 75.59,54.56 76.2,54.56 IC5.13
N$17
  Top 0.152: IC4.8 88.85,67.36 86.41,67.36 IC4.9 84.81,65.76 77.34,65.76 69.42,57.84 36.8,57.84 34.06,55.09 29.49,55.09 23.01,48.62 13.03,48.62 7.62,43.2 3.81,43.2 SYNCHRO.2
N$18
  Top 0.152: R56.1 95.25,19.05 96.16,18.14 96.16,14.94 95.25,14.02 CTR0.2
N$19
  Top 0.152: R26.1 68.58,47.02 71.09,47.02 R22.2 71.17,47.02 72.69,48.54 74.07,48.54 75.59,47.02 76.2,47.02 IC5.2
N$21
  Top 0.152: R9.2 C5.2 6.4,52.12 6.4,55.93 8.84,58.37 8.84,59.66 R7.2
  Bottom 0.152: X2.2 17.83,67.36 16.54,67.36 IC1.6 16.46,67.28 8.91,59.74 R7.2
N$23
  Top 0.152: R25.1 96.47,47.02 94.03,47.02 R21.2 IC5.9
N$25
  Top 0.152: R4.2 C5.1
N$26
  Top 0.152: R25.2 96.47,54.56 95.25,54.56 94.41,53.72 89.76,53.72 88.92,54.56 IC5.8
  Bottom 0.152: IC5.8 85.42,51.13 85.42,46.63 81.31,42.52 81.31,41.91 IC7.12
N$27
  Bottom 0.152: IC7.2 73.69,34.29 73.69,40.01 74.6,40.92 74.6,46.02 73.69,46.94 IC5.1 73.61,47.02 68.58,52.05 R26.2
N$28
  Top 0.152: 14.02,57.15 14.02,57.23 16.46,59.66 IC1.3 16.46,59.74 16.46,63.55 11.43,68.58 R1.2 | 14.02,57.15 14.02,55.93 C4.2 | 14.02,57.15 R4.1
N$29
  Top 0.152: IC7.5 80.7,34.29 79.1,35.89 78.41,35.89 77.11,34.59 77.11,33.22 76.58,32.69 68.89,32.69 67.28,34.29 67.28,45.72 66.06,46.94 R27.2
  Bottom 0.152: R27.2 66.98,47.93 66.98,54.33 68.2,55.55 71.48,55.55 72.39,54.63 73.61,54.63 IC5.14
N$30
  Top 0.152: D1.A 3.81,67.36 6.33,67.36 D2.C 6.4,67.36 8.84,67.36 R7.1 | R7.1 13.95,62.26 13.95,59.74 IC1.2 | R3.2 11.43,71.17 8.91,68.66 8.91,67.36 R7.1
N$31
  Top 0.152: R9.1 D1.C 3.81,59.74 6.33,59.74 D2.A
N$32
  Top 0.152: R40.1 69.19,34.29 74.52,39.62 75.89,39.62 76.2,39.93 IC7.14
N$33
  Top 0.152: IC9.2 38.1,47.02 38.71,47.02 44.65,52.96 56.31,52.96 62.56,46.71 62.56,45.34 65.99,41.91 R44.2
  Bottom 0.152: R40.2 R44.2
N$34
  Bottom 0.152: R41.1 64.77,34.29 70.79,40.31 72.01,40.31 73.61,41.91 IC7.15
N$35
  Top 0.152: R41.2 R45.2 60.05,42.82 55.55,42.82 51.44,46.94 50.83,46.94 IC9.7
N$36
  Top 0.152: R42.1 60.96,45.72 66.98,39.7 66.98,34.14 68.73,32.38 76.81,32.38 78.72,34.29 IC7.4
N$37
  Top 0.152: IC9.10 50.83,54.63 51.44,54.63 52.96,56.16 56.84,56.16 58.37,54.63 R46.2 58.45,54.63 60.96,54.63 R42.2
N$38
  Top 0.152: R44.1 65.99,34.29 58.37,41.91 C25.1
N$39
  Top 0.152: R45.1 C26.1
N$40
  Top 0.152: C27.1 55.93,47.02 58.37,47.02 R46.1
N$41
  Top 0.152: R39.1 94.03,34.29 94.03,39.47 96.47,41.91 R36.2
  Bottom 0.152: IC5.6 86.41,46.94 87.02,46.94 91.14,42.82 95.56,42.82 96.47,41.91 R36.2
N$42
  Top 0.152: R39.2 93.95,41.91 88.92,46.94 IC5.7 88.85,47.02 82.91,52.96 82.91,60.05 81.69,61.27 73.3,61.27 68.66,56.62 50.83,56.62 48.84,54.63 48.31,54.63 IC9.11
N$43
  Top 0.152: R37.2 IC6.14 35.59,41.91 40.62,46.94 IC9.3
N$44
  Top 0.152: R38.2 IC6.8 50.75,41.91 48.31,44.35 48.31,46.94 IC9.6
N$45
  Top 0.152: IC6.9 48.84,41.91 50.44,40.31 53.34,40.31 | 53.34,40.31 54.25,40.31 55.85,41.91 R35.2 | 53.34,40.31 R38.1
N$46
  Top 0.152: 30.48,40.31 30.48,36.8 32.99,34.29 R37.1 | 30.48,40.31 R34.2 | IC6.13 37.49,41.91 35.89,40.31 30.48,40.31
N$47
  Top 0.152: IC6.2 R28.2 | C22.1 32.99,24.16 35.51,24.16 R31.1
  Bottom 0.152: R28.2 38.1,26.67 R31.1
N$48
  Top 0.152: IC6.1 35.59,34.29 35.59,31.77 R31.2 35.51,31.7 32.99,31.7 31.77,30.48 C22.2 31.7,30.48 30.48,31.7 R34.1
N$49
  Top 0.152: IC6.6 48.23,34.29 48.23,31.77 R29.2 48.31,31.7 48.31,26.59 50.75,24.16 R32.1 50.83,24.16 54.63,24.16 C23.1
N$50
  Top 0.152: 50.83,31.77 50.83,34.29 IC6.7 | 55.85,31.77 55.85,30.48 C23.2 | 55.85,31.77 55.85,34.29 R35.1 | 55.85,31.77 50.83,31.77 | 50.83,31.77 R32.2
N$51
  Top 0.152: C10.1 77.5,10.13 74.98,10.13 IC3.14
N$52
  Top 0.152: IC10.6 R30.2 20.34,31.7 20.34,26.67 22.86,24.16 | 22.86,24.16 25.45,24.16 26.67,25.38 C24.1 | 22.86,24.16 R33.1
N$53
  Top 0.152: R33.2 22.86,31.77 25.38,34.29 IC10.7
  Bottom 0.152: C24.2 27.96,31.77 | 27.96,31.77 28.88,32.69 51.13,32.69 51.44,32.38 76.28,32.38 77.11,33.22 77.11,35.05 82.22,40.16 82.22,42.29 83.44,43.51 89.23,43.51 96.47,36.27 96.47,34.29 R36.1 | 27.96,31.77 25.45,34.29 IC10.7
N$54
  Bottom 0.152: IC3.16 72.39,17.75 72.24,17.75 68.73,14.25 25.53,14.25 23.16,16.61 16.15,16.61 14.71,18.06 13.79,18.06 12.88,18.97 USB.3
N$55
  Top 0.152: R51.1 6.4,25.45 7.7,25.45 10.13,27.89 C29.1 10.21,27.96 12.65,30.4 12.65,34.29 IC10.2
  Bottom 0.152: IC9.4 43.13,47.02 42.6,47.02 41.07,48.54 31.32,48.54 30.71,47.93 24.38,47.93 18.67,42.22 18.67,40.23 12.72,34.29 IC10.2
N$56
  Top 0.152: 10.13,32.99 10.13,34.29 IC10.1 10.13,32.99 | 10.13,32.99 10.13,30.48 C29.2 | SYNCHRO.5 3.81,35.59 6.33,33.07 R51.2 6.4,32.99 10.13,32.99
N$57
  Top 0.152: IC10.9 R52.1 22.86,44.5 25.3,46.94 27.89,46.94 C30.1
  Bottom 0.152: IC9.5 45.72,46.94 45.11,46.94 43.59,45.41 29.49,45.41 27.96,46.94 C30.1
N$58
  Top 0.152: R52.2 C30.2
  Bottom 0.152: R52.2 30.48,44.42 27.96,41.91 IC10.8 25.38,41.91 23.77,40.31 19.28,40.31 14.33,35.36 14.33,33.98 13.03,32.69 9.83,32.69 4.42,38.1 SYNCHRO.4
N$59
  Top 0.152: IC10.13 13.26,41.91 15.77,44.42 17.75,44.42 R53.1 17.75,44.5 17.75,46.94 C31.1 17.83,47.02 21.87,47.02 25.53,50.67 41.22,50.67 45.11,54.56 45.72,54.56 IC9.12
N$60
  Top 0.152: 10.13,41.91 10.13,44.42 R53.2 12.65,46.94 15.24,46.94 C31.2 | 10.13,41.91 8.91,40.69 3.81,40.69 SYNCHRO.3 | 10.13,41.91 IC10.14
N$61
  Bottom 0.152: IC3.15 74.91,17.83 74.3,17.83 72.77,19.36 72.01,19.36 70.79,18.14 70.79,16.76 68.96,14.94 31.7,14.94 27.66,18.97 14.94,18.97 USB.2
N$62
  Bottom 0.152: R5.1 31.7,6.4 28.35,6.4 23.24,11.51 19.81,11.51 14.86,16.46 USB.1
N$63
  Top 0.152: R5.2 39.4,6.33 41.91,6.33 R8.2
  Bottom 0.152: IC3.13 72.39,10.21 71.78,10.21 70.26,11.73 46.63,11.73 45.34,10.44 45.34,9.07 42.67,6.4 41.91,6.4 R8.2
N$64
  Top 0.152: DOA.1 21.49,16.61 21.49,14.94 22.4,14.02 23.24,14.02 24.54,12.72 29.18,12.72 RST.2
N$65
  Top 0.152: 65.99,6.33 65.99,8.91 64.77,10.13 IC3.10 | 65.99,6.33 65.99,5.11 Q1.1 | 65.99,6.33 72.39,6.33 C7.2
N$66
  Top 0.152: 60.96,6.33 60.96,8.91 62.18,10.13 IC3.9 | 60.96,6.33 Q1.2 | 60.96,6.33 54.63,6.33 C6.2
N$67
  Top 0.152: R6.1 36.88,10.13 41.91,10.13 IC3.1
  Bottom 0.152: RST.3 29.26,10.21 33.07,10.21 33.91,11.05 35.97,11.05 36.8,10.21 R6.1
N$68
  Bottom 0.152: IC3.28 41.91,17.83 39.78,17.83 34.37,23.24 21.18,23.24 20.34,24.08 R30.1
N$69
  Top 0.152: IC3.26 47.02,17.83 47.02,22.86 48.23,24.08 R29.1
N$70
  Top 0.152: R28.1 38.1,24.08 44.42,17.75 IC3.27
N$71
  Top 0.508: DOA.9 20.34,7.62 20.34,10.13 DOA.7 | DOA.8 22.86,10.21 20.57,10.21 DOA.7 | DOA.5 20.34,12.65 20.34,10.36 DOA.7
N$72  (via drill 0.3)
  Top 0.152: v33.22,15.47 31.17,15.47 28.88,17.75 22.86,17.75 DOA.2
  Bottom 0.152: v33.22,15.47 56.77,15.47 59.05,17.75 59.66,17.75 IC3.21
N$73
  Top 0.152: R10.1 34.29,19.05 DIAG.K
N$74
  Top 0.152: IC3.6 53.03,11.73 37.11,11.73 35.59,10.21 34.29,10.21 R10.2
N$75
  Top 0.152: DOA.10 28.88,7.62 33.3,12.04 50.83,12.04 56.54,17.75 57.15,17.75 IC3.22
N$76
  Top 0.152: IC3.18 67.28,17.83 67.28,24.08 R24.1 67.36,24.16 69.8,24.16 USB/DOA.2
N$77
  Bottom 0.152: SV2.2 79.48,4.34 76.28,4.34 70.48,10.13 69.88,10.13 IC3.12
N$78
  Bottom 0.152: IC7.11 83.82,41.3 77.8,35.28 77.8,33.45 76.43,32.08 64.39,32.08 50.14,17.83 49.53,17.83 IC3.25
N$79  (via drill 0.3)
  Top 0.152: v72.24,22.1 72.54,22.1 76.58,26.14 76.58,28.35 80.92,32.69 84.2,32.69 85.42,33.91 85.42,41 86.33,41.91 IC7.10
  Bottom 0.152: v72.24,22.1 68.96,18.82 68.96,17.45 67.74,16.23 64.39,16.23 63.86,16.76 63.86,18.14 62.64,19.36 61.87,19.36 61.34,19.89 61.34,19.96 60.05,21.26 56.16,21.26 52.73,17.83 52.12,17.83 IC3.24
N$80  (via drill 0.3)
  Top 0.152: v80.16,32.69 76.43,28.96 63.25,28.96 54.63,20.34 54.63,17.83 IC3.23
  Bottom 0.152: v80.16,32.69 81.61,32.69 82.91,33.98 82.91,35.97 88.85,41.91 IC7.9
N$81
  Bottom 0.152: SV1.1 IC3.2
N$82
  Bottom 0.152: IC3.3 46.94,10.13 42.82,6.02 42.82,5.94 39.4,2.52 SV1.2
N$83
  Top 0.152: IC3.4 49.53,10.13 41.91,2.52 SV1.3
N$84
  Top 0.152: SV1.4 IC3.5
N$85
  Bottom 0.152: IC3.7 57.15,10.13 56.54,10.13 50.75,4.34 48.77,4.34 47.02,2.59 SV1.5
N$86
  Top 0.152: IC3.11 67.36,10.13 67.89,10.13 70.79,7.24 74.07,7.24 78.72,2.59 SV2.1
N$87
  Top 0.152: IC3.17 69.88,17.83 69.88,21.95 70.87,22.94 70.87,26.9 69.88,27.89 R43.1
N$88
  Top 0.152: R43.2 77.5,27.89 77.5,25.45 R47.1 IC8.2
  Bottom 0.152: C28.1 IC8.2
N$89
  Top 0.152: 80.01,17.75 77.5,17.75 R47.2 | 80.01,17.75 82.53,17.75 IC8.1 82.6,17.75 82.6,17.14 84.77,14.97 | 80.01,17.75 R48.1 | 84.77,14.97 83.82,14.02 C28.2 | 84.77,14.97 84.81,15.01 89.38,15.01 90.37,14.02 92.66,14.02 CTR0.1
N$91
  Top 0.152: 90.14,27.96 87.63,27.96 R49.2 | 90.14,27.96 92.66,30.48 C32.1 | 90.14,27.96 R54.1
  Bottom 0.152: R54.1 91.06,27.05 91.06,25.76 92.66,24.16 92.66,17.83 R50.2
N$92
  Top 0.152: IC8.5 90.22,25.38 92.66,25.38 R50.1
N$93
  Top 0.152: X1.1 15.24,72.39 19.43,68.2 22.02,68.2 25.45,64.77 C3.1
N$94
  Top 0.152: R56.2 95.25,16.15 93.73,14.63 93.73,11.96 86.41,4.65 86.41,2.59 SV2.4
SIN000
  Top 0.152: R19.2 67.36,69.88 69.8,69.88 R19.3 69.88,69.8 72.31,67.36 73.61,67.36 IC4.14 | R21.1 93.95,54.63 90.83,54.63 87.33,58.14 85.34,58.14 83.82,59.66 IC4.5
  Bottom 0.152: 79.63,58.14 79.63,58.83 78.79,59.66 IC4.3 78.72,59.74 73.69,64.77 73.69,67.28 IC4.14 | 79.63,58.14 79.63,45.95 78.79,45.11 78.79,41.91 IC7.13 | 79.63,58.14 81.69,58.14 83.21,59.66 83.82,59.66 IC4.5 IC4.10
SIN120
  Top 0.152: R22.1 71.17,54.63 71.17,57.23 73.61,59.66 IC4.1 73.69,59.74 76.2,59.74 IC4.2 76.2,59.66 77.11,58.75 77.11,40.39 71.17,34.44 71.17,34.29 IC7.1
SIN240  (via drill 0.3)
  Top 0.152: IC4.6 86.41,59.74 88.85,59.74 IC4.7 | v80.54,50.75 77.72,47.93 77.72,35.81 IC7.3
  Bottom 0.152: IC7.3 74.6,32.69 63.78,32.69 62.56,33.91 62.56,42.29 63.48,43.2 63.48,46.94 R23.1 | v80.54,50.75 82.22,52.43 82.22,54.94 86.33,59.05 86.33,59.66 IC4.6

### Text on the board
Top: henkie
Bottom: henkie
tNames: -5V | +5V | GAIN | SENS | SYNCHRO DRIVE | SDI / V2.0 | PHCC